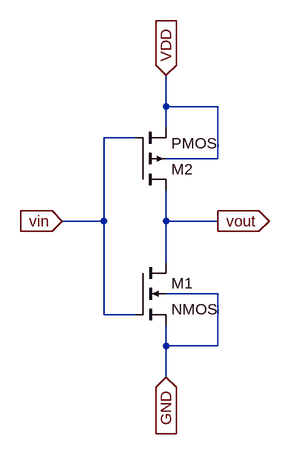
[diagram p0: schematic Not.asc]
Not.asc, the LTspice schematic file:
Version 4
SHEET 1 880 680
WIRE 400 -80 400 -128
WIRE 480 -80 400 -80
WIRE 400 -48 400 -80
WIRE 352 -32 304 -32
WIRE 480 0 480 -80
WIRE 480 0 400 0
WIRE 304 96 304 -32
WIRE 304 96 240 96
WIRE 400 96 400 48
WIRE 480 96 400 96
WIRE 400 160 400 96
WIRE 480 208 400 208
WIRE 304 240 304 96
WIRE 352 240 304 240
WIRE 400 288 400 256
WIRE 480 288 480 208
WIRE 480 288 400 288
WIRE 400 336 400 288
FLAG 400 -128 VDD
IOPIN 400 -128 In
FLAG 240 96 vin
IOPIN 240 96 In
FLAG 480 96 vout
IOPIN 480 96 Out
FLAG 400 336 GND
IOPIN 400 336 In
SYMBOL nmos4 352 160 R0
SYMATTR InstName M1
SYMBOL pmos4 352 48 M180
SYMATTR InstName M2

The netlist it stands for:
* Not.asc
M1 vout vin GND GND NMOS
M2 vout vin VDD VDD PMOS
.model NMOS NMOS
.model PMOS PMOS
.lib standard.mos
.backanno
.end